# EAGLE design SparkFun ESP32 Thing Plus DMX to LED Shield (EAGLE 9.1.0)
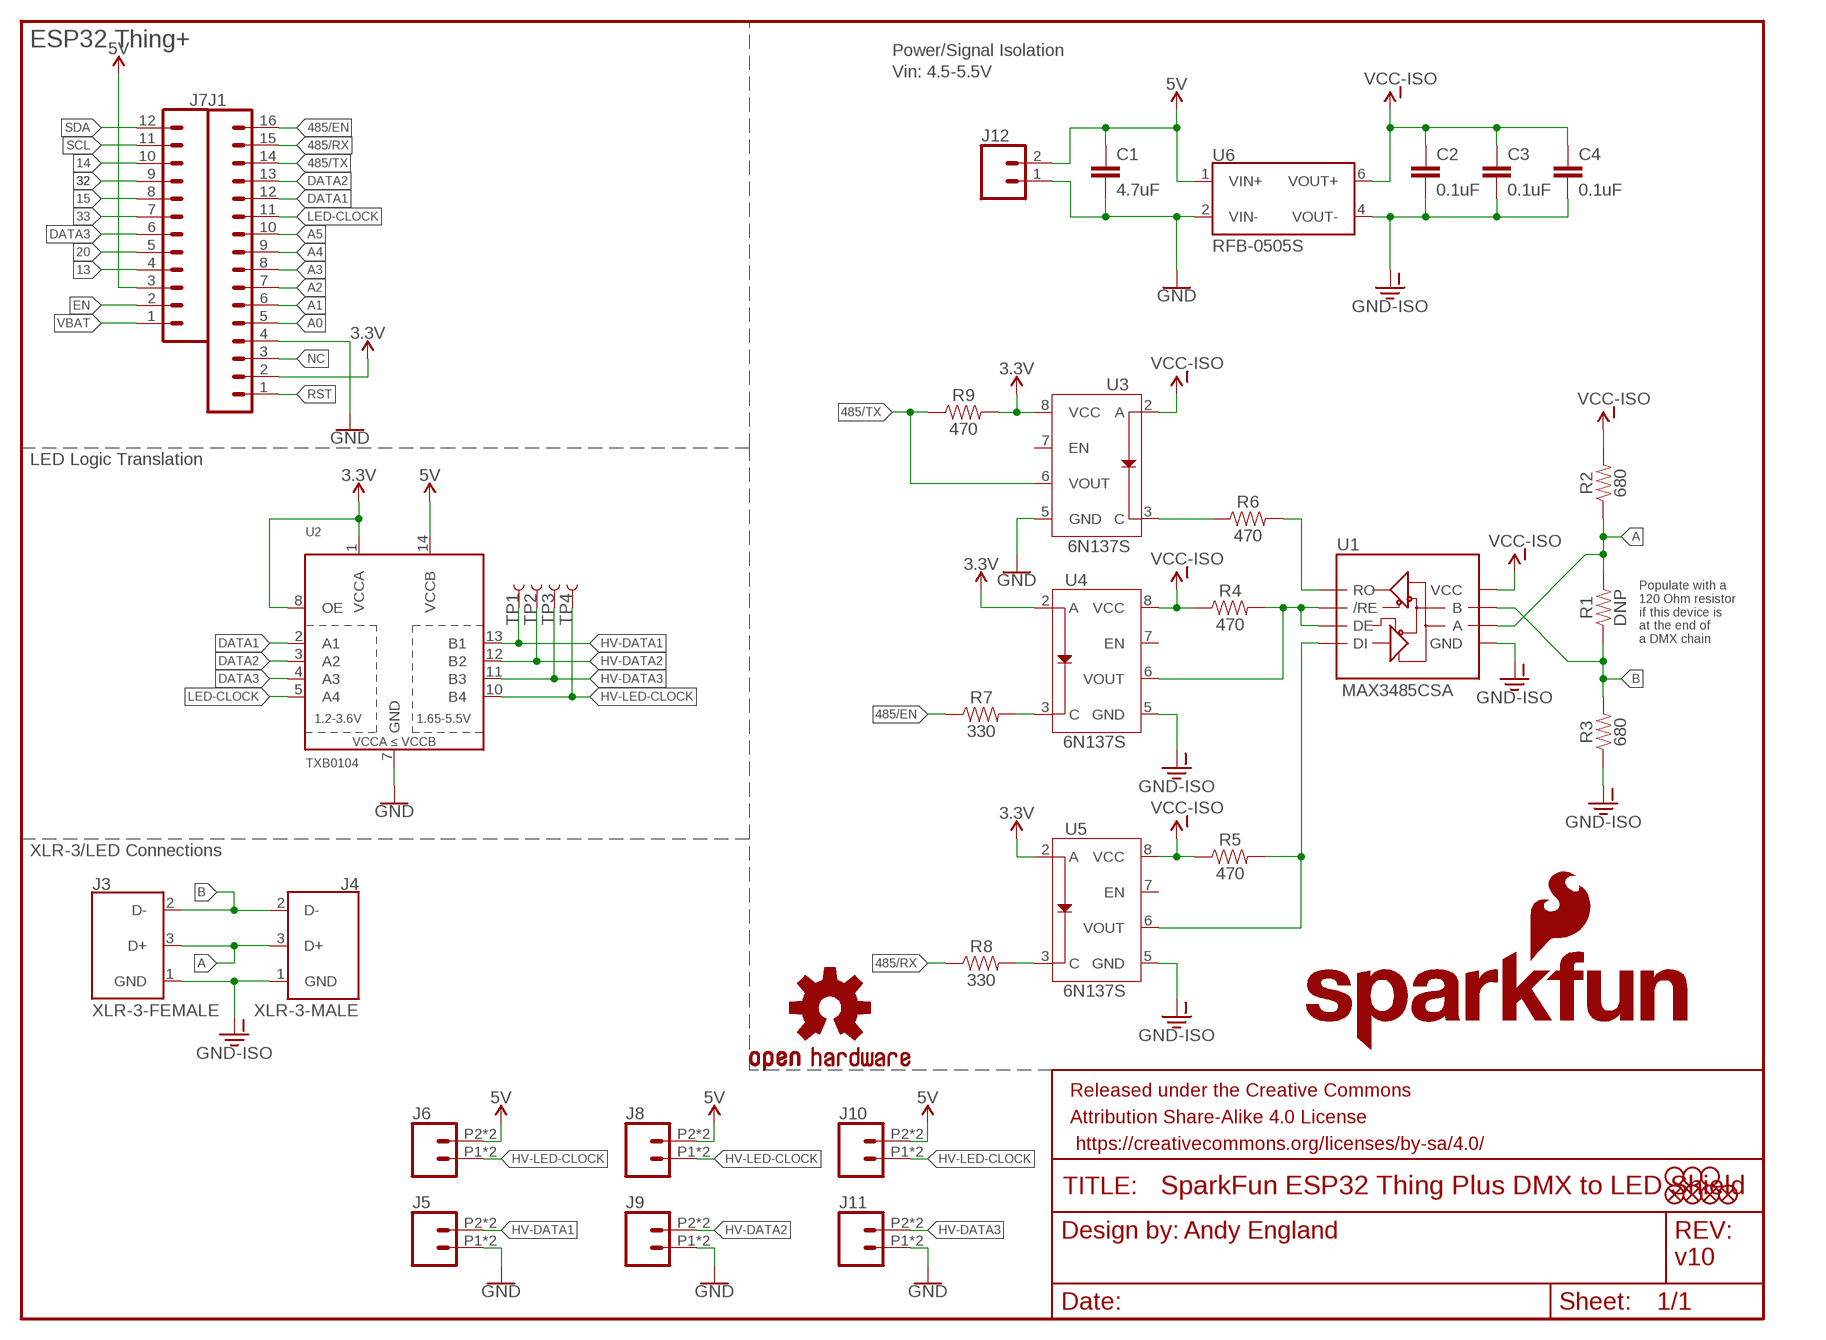
[diagram p0: schematic, sheet 1]

## Parts
C1  4.7uF  4.7UF-0603-6.3V-(10%)  [0603]
C2  0.1uF  0.1UF-0603-25V-(+80/-20%)  [0603]
C3  0.1uF  0.1UF-0603-25V-(+80/-20%)  [0603]
C4  0.1uF  0.1UF-0603-25V-(+80/-20%)  [0603]
FD1  FIDUCIALUFIDUCIAL  [FIDUCIAL-MICRO]
FD2  FIDUCIALUFIDUCIAL  [FIDUCIAL-MICRO]
FD3  FIDUCIALUFIDUCIAL  [FIDUCIAL-MICRO]
FD4  FIDUCIALUFIDUCIAL  [FIDUCIAL-MICRO]
FRAME1  FRAME-LETTER  [CREATIVE_COMMONS]
H1  STAND-OFFTIGHT  [STAND-OFF-TIGHT]
H2  STAND-OFFTIGHT  [STAND-OFF-TIGHT]
H3  STAND-OFFTIGHT  [STAND-OFF-TIGHT]
J1  CONN_16LOCK_NO_SILK  [1X16_LOCK_NO_SILK]
J3  XLR-3-FEMALE  [XLR-3_FEMALE]
J4  XLR-3-MALE  [XLR-3_MALE]
J5  CONN_02SMALL_POKEHOME  [1X02_POKEHOME]
J6  CONN_02SMALL_POKEHOME  [1X02_POKEHOME]
J7  CONN_12LOCK_NO_SILK  [1X12_LOCK_NO_SILK]
J8  CONN_02SMALL_POKEHOME  [1X02_POKEHOME]
J9  CONN_02SMALL_POKEHOME  [1X02_POKEHOME]
J10  CONN_02SMALL_POKEHOME  [1X02_POKEHOME]
J11  CONN_02SMALL_POKEHOME  [1X02_POKEHOME]
J12  CONN_023.5MM  [SCREWTERMINAL-3.5MM-2]
LOGO1  SFE_LOGO_NAME_FLAME.2_INCH  [SFE_LOGO_NAME_FLAME_.2]
LOGO2  SFE_LOGO_NAME_FLAME.2_INCH  [SFE_LOGO_NAME_FLAME_.2]
LOGO3  OSHW-LOGOS  [OSHW-LOGO-S]
R1  DNP  100OHM-HORIZ_KIT-1/4W-1%  [AXIAL-0.3EZ]
R2  680  680OHM-0603-1/10W-5%  [0603]
R3  680  680OHM-0603-1/10W-5%  [0603]
R4  470  470OHM-0603-1/10W-1%  [0603]
R5  470  470OHM-0603-1/10W-1%  [0603]
R6  470  470OHM-0603-1/10W-1%  [0603]
R7  330  330OHM-0603-1/10W-1%  [0603]
R8  330  330OHM-0603-1/10W-1%  [0603]
R9  470  470OHM-0603-1/10W-1%  [0603]
TP1  TEST-POINT3  [PAD.03X.03]
TP2  TEST-POINT3  [PAD.03X.03]
TP3  TEST-POINT3  [PAD.03X.03]
TP4  TEST-POINT3  [PAD.03X.03]
U1  MAX3485CSA  RS485SOIC  [SO08]
U2  TXB0104  TXB0104PWR  [TSSOP14]
U3  6N137S  [8-SMD]
U4  6N137S  [8-SMD]
U5  6N137S  [8-SMD]
U6  RFB-0505S  [RFB-0505S]

## Nets
3.3V: J1.2 R9.2 U2.1(VCCA) U2.8(OE) U3.8(VCC) U4.2(A) U5.2(A)
5V: C1.1 J6.P2 J6.P4 J7.3 J8.P2 J8.P4 J10.P2 J10.P4 J12.2 U2.14(VCCB) U6.1(VIN+)
13: J7.4
14: J7.10
15: J7.8
20: J7.5
32: J7.9
33: J7.7
485/EN: J1.16 R7.1
485/RX: J1.15 R8.1
485/TX: J1.14 R9.1 U3.6(VOUT)
A: J3.3(D+) J4.3(D+) R1.P$2 R2.1 U1.6(A)
A0: J1.5
A1: J1.6
A2: J1.7
A3: J1.8
A4: J1.9
A5: J1.10
B: J3.2(D-) J4.2(D-) R1.P$1 R3.2 U1.7(B)
DATA1: J1.12 U2.2(A1)
DATA2: J1.13 U2.3(A2)
DATA3: J7.6 U2.4(A3)
EN: J7.2
GND: C1.2 J1.4 J5.P1 J5.P3 J9.P1 J9.P3 J11.P1 J11.P3 J12.1 U2.7(GND) U3.5(GND) U6.2(VIN-)
GND-ISO: C2.2 C3.2 C4.2 J3.1(GND) J4.1(GND) R3.1 U1.5(GND) U4.5(GND) U5.5(GND) U6.4(VOUT-)
HV-DATA1: J5.P2 J5.P4 TP1.P$1 U2.13(B1)
HV-DATA2: J9.P2 J9.P4 TP2.P$1 U2.12(B2)
HV-DATA3: J11.P2 J11.P4 TP3.P$1 U2.11(B3)
HV-LED-CLOCK: J6.P1 J6.P3 J8.P1 J8.P3 J10.P1 J10.P3 TP4.P$1 U2.10(B4)
LED-CLOCK: J1.11 U2.5(A4)
N$1: R8.2 U5.3(C)
N$2: R7.2 U4.3(C)
N$3: R4.2 U1.2(/RE) U1.3(DE) U4.6(VOUT)
N$4: R5.2 U1.4(DI) U5.6(VOUT)
N$5: R6.1 U3.3(C)
N$6: R6.2 U1.1(RO)
NC: J1.3
RST: J1.1
SCL: J7.11
SDA: J7.12
VBAT: J7.1
VCC-ISO: C2.1 C3.1 C4.1 R2.2 R4.1 R5.1 U1.8(VCC) U3.2(A) U4.8(VCC) U5.8(VCC) U6.6(VOUT+)
Unconnected: U3.7(EN) U4.7(EN) U5.7(EN)

## Notes on the sheet
- ESP32 Thing+
- Power/Signal Isolation
- Vin: 4.5-5.5V
- LED Logic Translation
- Populate with a 
  120 Ohm resistor 
  if this device is
  at the end of 
  a DMX chain
- XLR-3/LED Connections
- Andy England
- v10

## Library data of the parts
C1 = SparkFun-Capacitors:4.7UF: 4.7µF ceramic capacitors A capacitor is a passive two-terminal electrical component used to store electrical energy temporarily in an electric field.; PROD_ID: CAP-08280
C2-C4 = SparkFun-Capacitors:0.1UF: 0.1µF ceramic capacitors A capacitor is a passive two-terminal electrical component used to store electrical energy temporarily in an electric field.; PROD_ID: CAP-00810
FD1-FD4 = SparkFun-Aesthetics:FIDUCIAL: Fiducial Alignment Points Point-of-reference for pick-and-place machines and other optical instruments.
FRAME1 = SparkFun-Aesthetics:FRAME-LETTER: Schematic Frame - Letter Standard 8.5x11 US Letter frame
H1-H3 = SparkFun-Hardware:STAND-OFF: Stand Off Drill holes for mechanically mounting via screws, standoffs, etc. Note: Use the keepout ring to avoid running the screw head into surrounding components. Variant Overviews STAND-OFF - Mechanical footprint for a #4 phillips button head screw. STAND-OFF-TIGHT - Mechanical footprint for a #4 phillips button head screw, Example SparkFun Products Screw - Phillips Head (1/4", 4-40, 10 pack) <https://www.sparkfun.com/products/10453> (PRT-10453) Screw - Phillips Head (1/2", 4-40, 10 pack) <https://www.sparkfun.com/products/10452> (PRT-10452) Screw - Phillips Head (3/4", 4-40, 10 pack) <https://www.sparkfun.com/products/10451> (PRT-10451) Screw - Phillips Head (1", 4-40, 10 pack) <https://www.sparkfun.com/products/10450> (PRT-10450)
J1 = SparkFun-Connectors:CONN_16: Multi connection point. Often used as Generic Header-pin footprint for 0.1 inch spaced/style header connections On any of the 0.1 inch spaced packages, you can populate with these: Break Away Headers - Straight <https://www.sparkfun.com/products/116> (PRT-00116) Break Away Male Headers - Right Angle <https://www.sparkfun.com/products/553> (PRT-00553) Female Headers <https://www.sparkfun.com/products/115> (PRT-00115) Break Away Headers - Machine Pin <https://www.sparkfun.com/products/117> (PRT-00117) Break Away Female Headers - Swiss Machine Pin <https://www.sparkfun.com/products/743> (PRT-00743) For SCREWTERMINALS and SPRING TERMINALS visit here: Screw Terimnals on SparkFun.com <https://www.sparkfun.com/search/results?term=Screw+Terminals> (5mm/3.5mm/2.54mm spacing) This device is also useful as a general connection point to wire up your design to another part of your project. Our various solder wires solder well into these plated through hole pads. Hook-Up Wire - Assortment (Stranded, 22 AWG) <https://www.sparkfun.com/products/11375> (PRT-11375) Hook-Up Wire - Assortment (Solid Core, 22 AWG) <https://www.sparkfun.com/products/11367> (PRT-11367) View the entire wire category on our website here <https://www.sparkfun.com/categories/141> Special notes: Molex polarized connector foot print use with SKU : PRT-08231 with associated crimp pins and housings. 1MM SMD Version SKU: PRT-10208 NOTES ON THE VARIANTS LOCK and LOCK_LONGPADS... This footprint was designed to help hold the alignment of a through-hole component (i.e. 6-pin header) while soldering it into place. You may notice that each hole has been shifted either up or down by 0.005 of an inch from it's more standard position (which is a perfectly straight line). This slight alteration caused the pins (the squares in the middle) to touch the edges of the holes. Because they are alternating, it causes a "brace" to hold the component in place. 0.005 has proven to be the perfect amount of "off-center" position when using our standard breakaway headers. Although looks a little odd when you look at the bare footprint, once you have a header in there, the alteration is very hard to notice. Also,if you push a header all the way into place, it is covered up entirely on the bottom side.
J3 = SparkFun-Connectors:XLR-3: Neutrik XLR-3 Jack - XLR-3 Jack for DMX Symbol for a horizontal, 3-pin DMX connector; PROD_ID: CONN-14142
J4 = SparkFun-Connectors:XLR-3: Neutrik XLR-3 Jack - XLR-3 Jack for DMX Symbol for a horizontal, 3-pin DMX connector; PROD_ID: CONN-14141
J5 J6 J8-J11 = SparkFun-Connectors:CONN_02: Multi connection point. Often used as Generic Header-pin footprint for 0.1 inch spaced/style header connections On any of the 0.1 inch spaced packages, you can populate with these: Break Away Headers - Straight <https://www.sparkfun.com/products/116> (PRT-00116) Break Away Male Headers - Right Angle <https://www.sparkfun.com/products/553> (PRT-00553) Female Headers <https://www.sparkfun.com/products/115> (PRT-00115) Break Away Headers - Machine Pin <https://www.sparkfun.com/products/117> (PRT-00117) Break Away Female Headers - Swiss Machine Pin <https://www.sparkfun.com/products/743> (PRT-00743) For SCREWTERMINALS and SPRING TERMINALS visit here: Screw Terimnals on SparkFun.com <https://www.sparkfun.com/search/results?term=Screw+Terminals> (5mm/3.5mm/2.54mm spacing) This device is also useful as a general connection point to wire up your design to another part of your project. Our various solder wires solder well into these plated through hole pads. Hook-Up Wire - Assortment (Stranded, 22 AWG) <https://www.sparkfun.com/products/11375> (PRT-11375) Hook-Up Wire - Assortment (Solid Core, 22 AWG) <https://www.sparkfun.com/products/11367> (PRT-11367) View the entire wire category on our website here <https://www.sparkfun.com/categories/141> Special notes: Molex polarized connector foot print use with: PRT-08233 with associated crimp pins and housings. 2.54_SCREWTERM for use with PRT-10571. 3.5mm Screw Terminal footprints for PRT-08084 5mm Screw Terminal footprints for use with PRT-08432; PROD_ID: CONN-13512
J7 = SparkFun-Connectors:CONN_12: Multi connection point. Often used as Generic Header-pin footprint for 0.1 inch spaced/style header connections On any of the 0.1 inch spaced packages, you can populate with these: Break Away Headers - Straight <https://www.sparkfun.com/products/116> (PRT-00116) Break Away Male Headers - Right Angle <https://www.sparkfun.com/products/553> (PRT-00553) Female Headers <https://www.sparkfun.com/products/115> (PRT-00115) Break Away Headers - Machine Pin <https://www.sparkfun.com/products/117> (PRT-00117) Break Away Female Headers - Swiss Machine Pin <https://www.sparkfun.com/products/743> (PRT-00743) For SCREWTERMINALS and SPRING TERMINALS visit here: Screw Terimnals on SparkFun.com <https://www.sparkfun.com/search/results?term=Screw+Terminals> (5mm/3.5mm/2.54mm spacing) This device is also useful as a general connection point to wire up your design to another part of your project. Our various solder wires solder well into these plated through hole pads. Hook-Up Wire - Assortment (Stranded, 22 AWG) <https://www.sparkfun.com/products/11375> (PRT-11375) Hook-Up Wire - Assortment (Solid Core, 22 AWG) <https://www.sparkfun.com/products/11367> (PRT-11367) View the entire wire category on our website here <https://www.sparkfun.com/categories/141> Special notes: Molex polarized connector foot print use with SKU : PRT-08231 with associated crimp pins and housings. 1MM SMD Version SKU: PRT-10208 NOTES ON THE VARIANTS LOCK and LOCK_LONGPADS... This footprint was designed to help hold the alignment of a through-hole component (i.e. 6-pin header) while soldering it into place. You may notice that each hole has been shifted either up or down by 0.005 of an inch from it's more standard position (which is a perfectly straight line). This slight alteration caused the pins (the squares in the middle) to touch the edges of the holes. Because they are alternating, it causes a "brace" to hold the component in place. 0.005 has proven to be the perfect amount of "off-center" position when using our standard breakaway headers. Although looks a little odd when you look at the bare footprint, once you have a header in there, the alteration is very hard to notice. Also,if you push a header all the way into place, it is covered up entirely on the bottom side.
J12 = SparkFun-Connectors:CONN_02: Multi connection point. Often used as Generic Header-pin footprint for 0.1 inch spaced/style header connections On any of the 0.1 inch spaced packages, you can populate with these: Break Away Headers - Straight <https://www.sparkfun.com/products/116> (PRT-00116) Break Away Male Headers - Right Angle <https://www.sparkfun.com/products/553> (PRT-00553) Female Headers <https://www.sparkfun.com/products/115> (PRT-00115) Break Away Headers - Machine Pin <https://www.sparkfun.com/products/117> (PRT-00117) Break Away Female Headers - Swiss Machine Pin <https://www.sparkfun.com/products/743> (PRT-00743) For SCREWTERMINALS and SPRING TERMINALS visit here: Screw Terimnals on SparkFun.com <https://www.sparkfun.com/search/results?term=Screw+Terminals> (5mm/3.5mm/2.54mm spacing) This device is also useful as a general connection point to wire up your design to another part of your project. Our various solder wires solder well into these plated through hole pads. Hook-Up Wire - Assortment (Stranded, 22 AWG) <https://www.sparkfun.com/products/11375> (PRT-11375) Hook-Up Wire - Assortment (Solid Core, 22 AWG) <https://www.sparkfun.com/products/11367> (PRT-11367) View the entire wire category on our website here <https://www.sparkfun.com/categories/141> Special notes: Molex polarized connector foot print use with: PRT-08233 with associated crimp pins and housings. 2.54_SCREWTERM for use with PRT-10571. 3.5mm Screw Terminal footprints for PRT-08084 5mm Screw Terminal footprints for use with PRT-08432; PROD_ID: CONN-08399
LOGO1 LOGO2 = SparkFun-Aesthetics:SFE_LOGO_NAME_FLAME: SparkFun Font Logo w/ Flame This is the SparkFun full logo. The logo on the schematic will always be the same size; the package variant is the height of the flame part of the logo. Default layer for the logo on the board is tSilk.
LOGO3 = SparkFun-Aesthetics:OSHW-LOGO: Open-Source Hardware (OSHW) Logo This logo indicates the piece of hardware it is found on incorporates a OSHW license and/or adheres to the definition of open source hardware found here: http://freedomdefined.org/OSHW
R1 = SparkFun-Resistors:100OHM: 100Ω resistor A resistor is a passive two-terminal electrical component that implements electrical resistance as a circuit element. Resistors act to reduce current flow, and, at the same time, act to lower voltage levels within circuits. - Wikipedia; PROD_ID: RES-12181; VALUE: 100
R2 R3 = SparkFun-Resistors:680OHM: 680Ω resistor A resistor is a passive two-terminal electrical component that implements electrical resistance as a circuit element. Resistors act to reduce current flow, and, at the same time, act to lower voltage levels within circuits. - Wikipedia; PROD_ID: RES-09333
R4-R6 R9 = SparkFun-Resistors:470OHM: 470Ω resistor A resistor is a passive two-terminal electrical component that implements electrical resistance as a circuit element. Resistors act to reduce current flow, and, at the same time, act to lower voltage levels within circuits. - Wikipedia; PROD_ID: RES-07869
R7 R8 = SparkFun-Resistors:330OHM: 330Ω resistor A resistor is a passive two-terminal electrical component that implements electrical resistance as a circuit element. Resistors act to reduce current flow, and, at the same time, act to lower voltage levels within circuits. - Wikipedia; PROD_ID: RES-00818
TP1-TP4 = SparkFun-Connectors:TEST-POINT: SparkFun Test Points Bare copper test points for troubleshooting or In-Circuit-Testing. These are used by our Production team for verifying production board runs using pogo-pins on test beds. SparkFun Products: SparkFun LSM9DS1 Breakout <https://www.sparkfun.com/products/13284> SparkFun PSOC <https://www.sparkfun.com/products/13714> SparkFun Load Cell Amplifier <https://www.sparkfun.com/products/13879>
U1 = SparkFun-IC-Comms:RS485: RS-485 Transceiver SP3485 Series 8 Pin NSOIC 3.3 V Low Power Half Duplex RS-485 Transceiver MAX3485 compatible Datasheet <http://www.sparkfun.com/datasheets/Components/General/sp3485CN-LTR.pdf> SparkFun Products SparkFun Transceiver Breakout - RS-485 <https://www.sparkfun.com/products/10124> (BOB-10124) SparkFun USB to RS-485 Converter <https://www.sparkfun.com/products/9822> (BOB-09822); PROD_ID: IC-09388
U2 = SparkFun-IC-Comms:TXB0104PWR: 4-Bit Bi-Directional Level Shifter 1.2V-3.6V (VCCA) to 1.65V-5.5V (VCCB) bi-directional level shifter with auto direction sensing. Max data rate - VCCA 1.8V: 20Mbps (50ns), VCCA 3.3V: 100Mbps (10ns) Digikey: 296-21929-1-ND (TSSOP) Datasheet <http://cdn.sparkfun.com/datasheets/BreakoutBoards/txb0104.pdf> SparkFun Products SparkFun Cellular Shield - MG2639 <https://www.sparkfun.com/products/13120> (CEL-13120) SparkFun Level Shifting microSD Breakout <https://www.sparkfun.com/products/13743> (DEV-13743) SparkFun Voltage-Level Translator Breakout - TXB0104 <https://www.sparkfun.com/products/11771> (BOB-11771) SparkFun Block for Intel® Edison - UART <https://www.sparkfun.com/products/13040> (DEV-13040) SparkFun Block for Intel® Edison - Arduino <https://www.sparkfun.com/products/13036> (DEV-13036); PROD_ID: IC-13929
U3-U5 = SparkFun-DiscreteSemi:6N137S: Lite-On 6N137 - High Speed Opto Isolator Opto isolator capable of data rates up to 10MBd; PROD_ID: IC-14151
U6 = SparkFun-IC-Power:RFB-0505S: Recom Power RFB-0505S 1W DC/DC Converter This 1W DC/DC converter keeps two power supplies magnetically isolated. Supplies up to 200 mA @ 5V.; PROD_ID: IC-14143

## Board
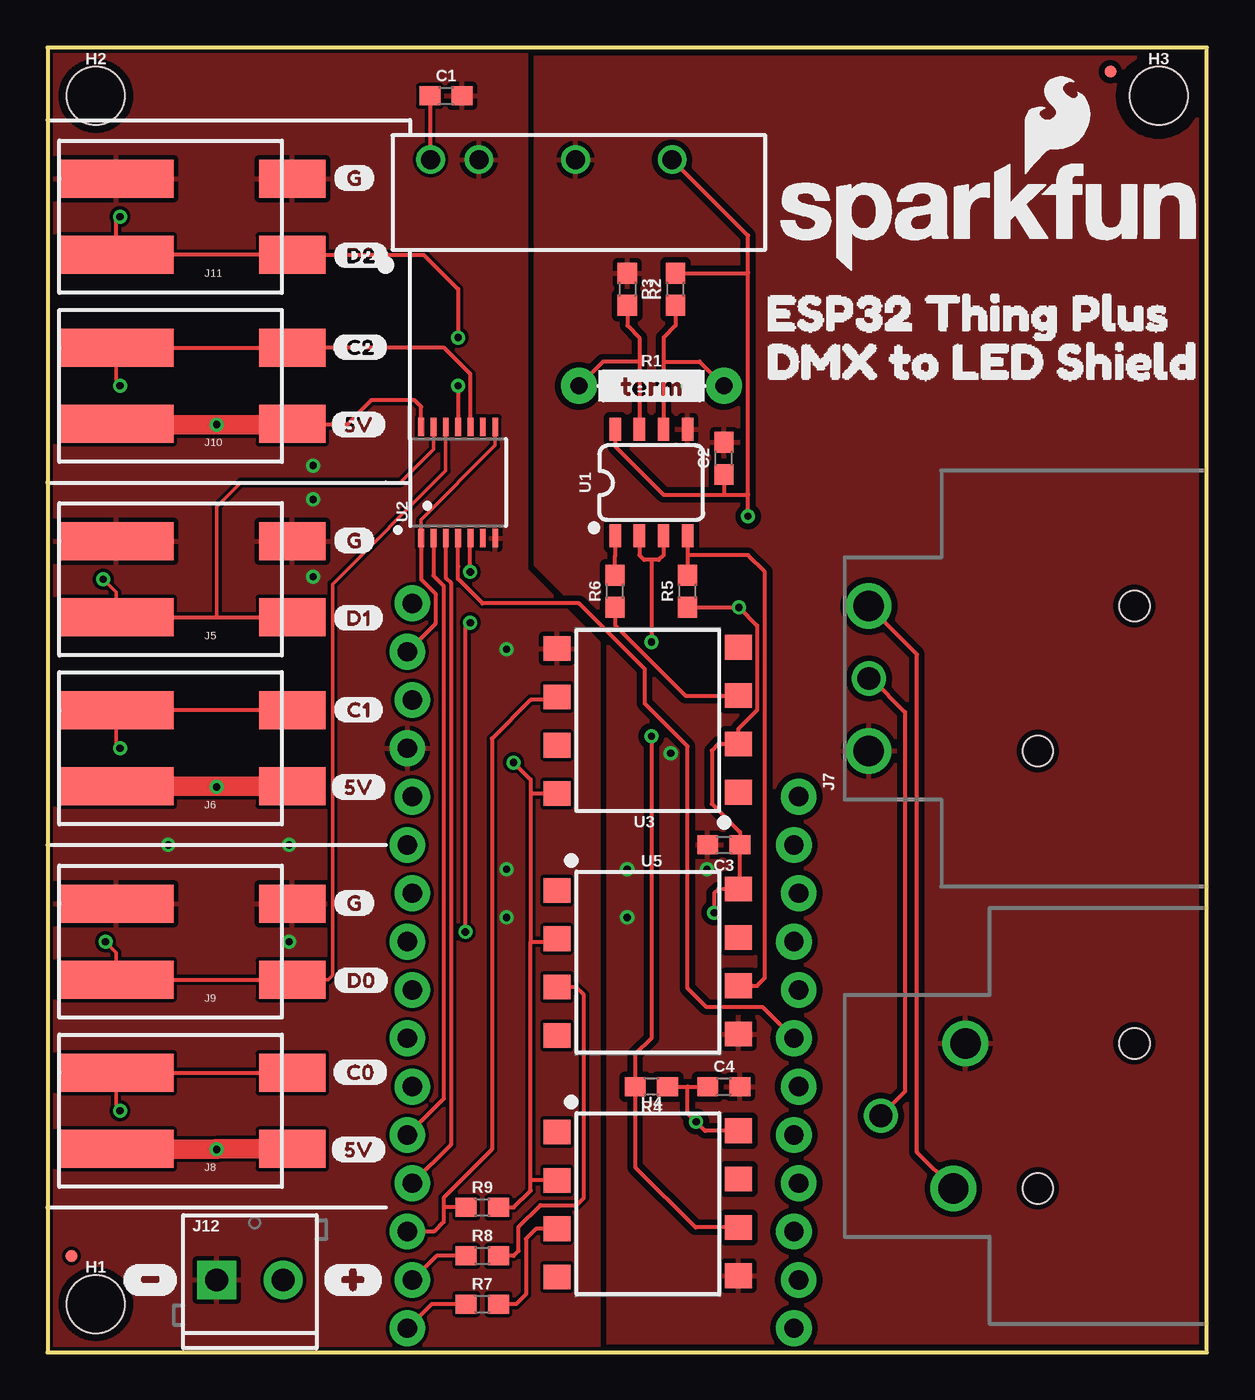
[diagram p1: board, top side]
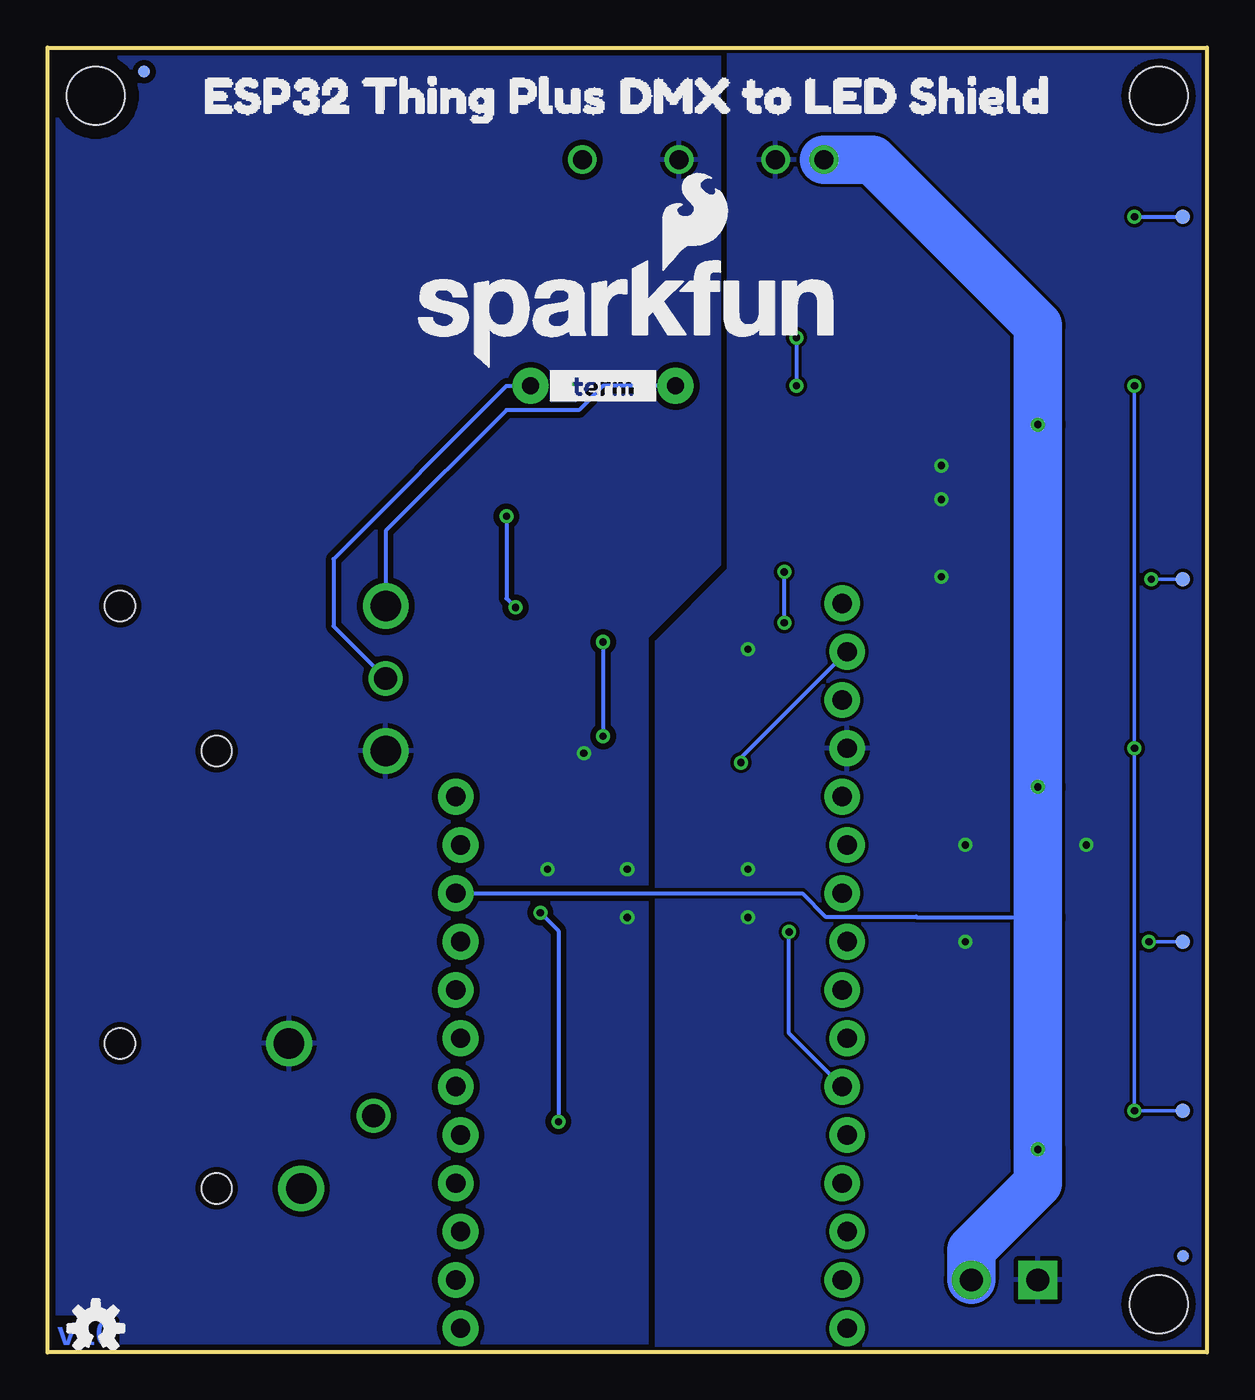
[diagram p2: board, bottom side, seen from below]

Size 60.96 x 68.58 mm. Coordinates in mm from the lower left corner, seen from the top.
Outline: 0,0 60.96,0 60.96,68.58 0,68.58 0,0
Copper layers (1*16): Top 0.035mm / dielectric 1.5mm / Bottom 0.035mm
Design rules "SparkFun-2-layer-TIGHT": minimum track width 7mil, minimum drill 15mil, track to track 7mil, track to pad 7mil, pad to pad 7mil, via to via 7mil, smd to smd 7mil, copper to edge 7mil, drill to drill 7mil, minimum pad ring 7mil, minimum via ring 7mil, stop-mask expansion 4mil, vias tented up to drill 25mil, thermal gap 10mil

### Footprints (pad centres in the part's own frame; a part is rotated, then mirrored left to right if it is on the bottom)
0603 = smd 1.1 x 1: 1 -0.85,0; 2 0.85,0
FIDUCIAL-MICRO = smd 0.635 x 0.635: 1 0,0
STAND-OFF-TIGHT = hole 3.048: 0,0
1X16_LOCK_NO_SILK = drill 1.016 pad 1.88: 1 -19.05,0.127; 2 -16.51,-0.127; 3 -13.97,0.127; 4 -11.43,-0.127; 5 -8.89,0.127; 6 -6.35,-0.127; 7 -3.81,0.127; 8 -1.27,-0.127; 9 1.27,0.127; 10 3.81,-0.127; 11 6.35,0.127; 12 8.89,-0.127; 13 11.43,0.127; 14 13.97,-0.127; 15 16.51,0.127; 16 19.05,-0.127
XLR-3_FEMALE = drill 1.6: 1 -3.81,0; 2 3.81,-0.635 | drill 1.2: 3 0,-4.445 | hole 1.6: -3.81,8.89; 3.81,3.81
XLR-3_MALE = drill 1.6: 1 3.81,-8.89; 2 -3.81,-8.89 | drill 1.2: 3 0,-8.89 | hole 1.6: -3.81,5.08; 3.81,0
1X02_POKEHOME = smd 3.5 x 2: P1 5.25,2; P2 5.25,-2 | smd 6 x 2: P3 -4,2; P4 -4,-2
1X12_LOCK_NO_SILK = drill 1.016 pad 1.88: 1 0,0.127; 2 2.54,-0.127; 3 5.08,0.127; 4 7.62,-0.127; 5 10.16,0.127; 6 12.7,-0.127; 7 15.24,0.127; 8 17.78,-0.127; 9 20.32,0.127; 10 22.86,-0.127; 11 25.4,0.127; 12 27.94,-0.127
SCREWTERMINAL-3.5MM-2 = drill 1.2 pad 2.032 square: 1 0,0 | drill 1.2 pad 2.032: 2 3.5,0
AXIAL-0.3EZ = drill 0.9 pad 1.88: P$1 -3.81,0; P$2 3.81,0
PAD.03X.03 = smd 0.762 x 0.762: P$1 0,0
SO08 = smd 0.6 x 1.2: 1 -1.905,-2.8; 2 -0.635,-2.8; 3 0.635,-2.8; 4 1.905,-2.8; 5 1.905,2.8; 6 0.635,2.8; 7 -0.635,2.8; 8 -1.905,2.8
TSSOP14 = smd 0.305 x 0.991: 1 -1.95,-2.918; 2 -1.3,-2.918; 3 -0.65,-2.918; 4 0,-2.918; 5 0.65,-2.918; 6 1.3,-2.918; 7 1.95,-2.918; 8 1.95,2.918; 9 1.3,2.918; 10 0.65,2.918; 11 0,2.918; 12 -0.65,2.918; 13 -1.3,2.918; 14 -1.95,2.918
8-SMD = smd 1.3 x 1.4: 1 -3.96,-4.96; 2 -1.42,-4.96; 3 1.12,-4.96; 4 3.66,-4.96; 5 3.59,4.58; 6 1.05,4.58; 7 -1.49,4.58; 8 -4.03,4.58
RFB-0505S = drill 1: 1 -7.8,1.73; 2 -5.26,1.73; 4 -0.18,1.73; 6 4.9,1.73

### Placement (x,y rotation side)
C1  20.95,66.04 0 top
C2  35.56,46.99 90 top
C3  35.56,26.67 180 top
C4  35.56,13.97 0 top
FD1  1.27,5.08 0 bottom
FD2  1.27,5.08 0 top
FD3  55.88,67.31 0 top
FD4  55.88,67.31 0 bottom
FRAME1  -2.54,-7.62 0 top  (outside the outline)
H1  2.54,2.54 0 top
H2  2.54,66.04 0 top
H3  58.42,66.04 0 top
J1  19.05,20.32 270 top
J3  48.26,12.43 270 top
J4  52.07,35.42 270 top
J5  7.62,40.64 0 top
J6  7.62,31.75 0 top
J7  39.37,29.21 270 top
J8  7.62,12.7 0 top
J9  7.62,21.59 0 top
J10  7.62,50.8 0 top
J11  7.62,59.69 0 top
J12  8.89,3.81 0 top
LOGO1  49.53,59.69 0 top
LOGO2  30.48,54.61 0 bottom
LOGO3  58.42,1.27 0 bottom
R1  31.75,50.8 0 top
R2  33.02,55.88 90 top
R3  30.48,55.88 270 top
R4  31.75,13.97 180 top
R5  33.66,40.01 90 top
R6  29.84,40.01 90 top
R7  22.86,2.54 0 top
R8  22.86,5.08 0 top
R9  22.86,7.62 0 top
TP1  1.27,40.64 0 bottom
TP2  1.27,21.59 0 bottom
TP3  1.27,59.69 0 bottom
TP4  1.27,12.7 0 bottom
U1  31.75,45.72 0 top
U2  21.59,45.72 0 top
U3  31.37,33.4 90 top
U4  31.75,7.62 270 top
U5  31.75,20.32 270 top
U6  27.94,60.96 0 top
U$1  [__TERM__0]  28.45,50.8 0 top
U$2  [__TERM__0]  35.05,50.8 0 bottom
U$11  [ESP32_THING_PLUS6]  36.2,54.61 0 top
U$12  [DMX_TO_LED_SHIELD7]  36.2,52.07 0 top
U$13  [ESP32_THING_PLUS6]  54.36,66.04 0 bottom
U$14  [DMX_TO_LED_SHIELD7]  32.51,66.04 0 bottom
U$15  [5V7]  14.86,48.77 0 top
U$16  [#0]  3.94,3.81 0 top
U$17  [5V7]  14.86,10.67 0 top
U$18  [C01]  14.99,14.73 0 top
U$19  [D00]  14.99,19.56 0 top
U$20  [G8]  14.99,61.72 0 top
U$21  [5V7]  14.86,29.72 0 top
U$22  [C12]  14.99,33.78 0 top
U$23  [D16]  14.99,38.61 0 top
U$24  [G8]  14.99,42.67 0 top
U$25  [#1]  14.48,3.81 0 top
U$26  [C24]  14.99,52.83 0 top
U$27  [D23]  14.99,57.66 0 top
U$28  [G8]  14.99,23.62 0 top

### Tracks (layer width: path | path; a pad name or v marks a point on that pad's centre or on a via)
3.3V  (via drill 0.38)
  Top 0.178: U2.1 19.64,43.77 23.54,47.67 U2.8
  Top 0.203: J1.2 20.4,38.3 20.4,39.88 19.64,40.63 U2.1 | R9.2 24.51,7.62 25.4,8.51 25.4,9 | U5.2 26.64,21.59 25.4,21.59 | 25.4,9 25.4,21.59 | U4.2 25.44,9.04 25.4,9 | v24.5,31 25.4,30.1 25.4,29.4 | 25.4,29.4 25.4,21.59 | U3.8 25.43,29.37 25.4,29.4
  Bottom 0.203: J1.2 24.5,31.25 v24.5,31
5V  (via drill 0.38)
  Top 0.203: 8.86,10.7 v8.89,10.67 | 12.84,48.77 J10.P2 12.9,48.77 15.75,48.77 17.02,50.04 19.3,50.04 19.64,49.7 U2.14 | J10.P4 3.65,48.77 | v8.89,29.72 8.89,29.75 | 3.65,10.67 J8.P4 | C1.1 20.11,62.73 U6.1
  Top 1.016: J6.P4 8.89,29.75 J6.P2 | J8.P2 8.86,10.7 | 3.65,48.77 v8.89,48.77 12.84,48.77 | v8.89,10.67 3.65,10.67
  Bottom 0.203: J7.3 25.4,24.13 25.15,24.13 21.28,24.13 20.06,22.91 15.29,22.91 15.24,22.86 8.89,22.86
  Bottom 2.54: J12.2 12.39,5.39 8.89,8.89 v8.89,10.67 8.89,22.86 v8.89,29.72 v8.89,48.77 8.89,53.98 17.6,62.69 U6.1
485/EN
  Top 0.203: R7.1 20.19,2.54 J1.16
485/RX
  Top 0.203: R8.1 20.45,5.08 J1.15
485/TX
  Top 0.203: U3.6 26.63,34.29 25.4,34.29 23.37,32.26 23.37,10.67 20.83,8.13 20.83,7.62 | 20.83,7.62 20.83,6.86 20.32,6.35 J1.14 | R9.1 20.83,7.62
A
  Top 0.203: 32.38,52.07 U1.6 | R1.P$2 34.29,52.07 32.38,52.07 | 32.38,52.07 32.38,53.34 33.02,53.98 R2.1 | J4.3 43.32,35.42 45.09,33.66 45.09,13.7 J3.3
  Bottom 0.203: R1.P$2 36.83,50.8 45.93,41.7 45.93,38.17 J4.3
B
  Top 0.203: 31.11,52.07 31.11,53.34 30.48,53.98 R3.2 | 31.11,52.07 U1.7 | 31.11,52.07 29.21,52.07 R1.P$1 | J3.2 45.72,10.53 45.72,36.69 J4.2
  Bottom 0.203: R1.P$1 31.75,50.8 33.02,49.53 36.83,49.53 43.18,43.18 J4.2
DATA1
  Top 0.203: U2.2 20.29,40.83 20.83,40.29 20.83,13.34 J1.12
DATA2
  Top 0.203: U2.3 20.94,40.72 21.21,40.45 21.21,10.92 J1.13
DATA3
  Top 0.203: 33.66,19.15 33.66,31.85 31.39,34.11 31.39,35.92 27.94,39.37 22.86,39.37 21.58,40.65 21.58,41.29 21.59,41.3 U2.4 | J7.6 37.61,18.15 34.66,18.15 33.66,19.15 | 33.66,19.15
GND  (via drill 0.38)
  other vias: 24.13,25.4 24.13,22.86 13.97,44.83 13.97,46.61 12.7,21.59 12.7,26.67 6.35,26.67 13.97,40.77 24.13,36.96
  pour Bottom: 0,68.58 25.15,68.58 25.15,41.15 28.96,37.34 28.96,0 0,0
  pour Top: 0,68.58 25.15,68.58 25.15,41.15 28.96,37.34 28.96,0 0,0
GND-ISO  (via drill 0.38)
  other vias: 30.48,25.4 30.48,22.86 34.67,25.4 33.66,50.8 32.77,31.5
  pour Top (isolate 0.305): 60.96,68.58 25.65,68.58 25.65,41.4 29.46,37.59 29.46,0 60.96,0
  pour Bottom (isolate 0.305): 60.96,68.58 25.65,68.58 25.65,41.4 29.46,37.59 29.46,0 60.96,0
HV-DATA1  (via drill 0.38)
  Top 0.178: U2.13 20.29,47.47 18.54,45.72 10.16,45.72 8.89,44.45 8.89,38.64 | J5.P4 3.62,39.94 v2.92,40.64
  Top 0.203: J5.P4 8.89,38.64 J5.P2
  Bottom 0.178: v2.92,40.64 TP1.P$1
HV-DATA2  (via drill 0.38)
  Top 0.178: J9.P2 14.76,19.59 14.99,19.81 14.99,40.39 20.94,46.34 U2.12 | J9.P4 3.62,21.02 v3.05,21.59
  Top 0.203: J9.P4 J9.P2
  Bottom 0.178: v3.05,21.59 TP2.P$1
HV-DATA3  (via drill 0.38)
  Top 0.203: v21.59,53.34 21.59,55.88 19.78,57.69 J11.P2 J11.P4 3.62,59.5 v3.81,59.69 | v21.59,50.8 U2.11
  Bottom 0.203: v21.59,53.34 v21.59,50.8 | v3.81,59.69 TP3.P$1
HV-LED-CLOCK  (via drill 0.38)
  Top 0.178: J10.P3 3.62,50.99 v3.81,50.8 | v3.81,31.75 3.62,31.94 J6.P3 | v3.81,12.7 3.62,12.89 J8.P3
  Top 0.203: J10.P3 J10.P1 20.86,52.8 22.24,51.42 U2.10 | J8.P3 J8.P1 | J6.P1 J6.P3
  Bottom 0.178: v3.81,50.8 v3.81,31.75 v3.81,12.7 TP4.P$1
LED-CLOCK  (via drill 0.38)
  Top 0.203: v21.97,22.1 21.97,38.1 v22.23,38.35 | v22.23,41.02 22.23,42.79 U2.5
  Bottom 0.203: v22.23,38.35 v22.23,41.02 | v21.97,22.1 21.97,16.76 J1.11
N$1
  Top 0.203: U5.3 27.79,19.2 28.19,18.8 28.19,8.13 27.81,7.75 25.91,7.75 24.77,6.6 24.77,5.33 24.51,5.08 R8.2
N$2
  Top 0.203: U4.3 25.68,6.5 25.15,5.97 25.15,3.05 24.64,2.54 R7.2
N$3  (via drill 0.38)
  Top 0.203: 31.75,41.66 32.13,41.66 32.38,41.91 U1.3 | 31.75,41.66 31.37,41.66 31.11,41.91 U1.2 | U4.6 34.07,6.57 30.9,9.74 R4.2 30.9,15.66 31.75,16.51 v31.75,32.38 | 31.75,41.66 v31.75,37.34
  Bottom 0.203: v31.75,37.34 v31.75,32.38
N$4
  Top 0.203: U1.4 33.66,41.91 | 33.66,41.91 R5.2 | U5.6 37.3,19.27 37.72,19.68 37.72,41.02 36.83,41.91 33.66,41.91
N$5
  Top 0.203: R6.1 29.84,38.23 33.55,34.52 U3.3
N$6
  Top 0.203: U1.1 29.84,41.87 R6.2
VCC-ISO  (via drill 0.38)
  Top 0.203: U1.8 29.84,47.62 32.38,45.09 35.56,45.09 | R4.1 33.66,13.97 | 33.66,13.97 C4.1 | U4.8 34.58,11.65 v34.1,12.13 33.91,12.32 33.66,12.57 33.66,13.97 | v35.05,23.11 35.05,24.13 35.27,24.35 U5.8 36.41,24.43 C3.1 36.41,27.34 34.92,28.83 34.92,31.62 35.28,31.98 U3.2 | U3.2 36.33,32.78 37.31,33.76 37.31,38.2 v36.35,39.16 R5.1 | U3.2 | U6.6 36.83,58.7 36.83,56.77 | 36.83,45.09 36.83,56.77 | R2.2 36.79,56.73 36.83,56.77 | 35.56,45.09 36.83,45.09 | C2.1 35.56,45.09 | v36.83,43.94 36.83,45.09
  Bottom 0.203: v34.1,12.13 34.1,22.16 v35.05,23.11 | v36.83,43.94 36.83,39.63 v36.35,39.16

### Text on the board
Bottom: v10
tDocu: Andy England